# EAGLE schematic BCI_Module (EAGLE 6.4)
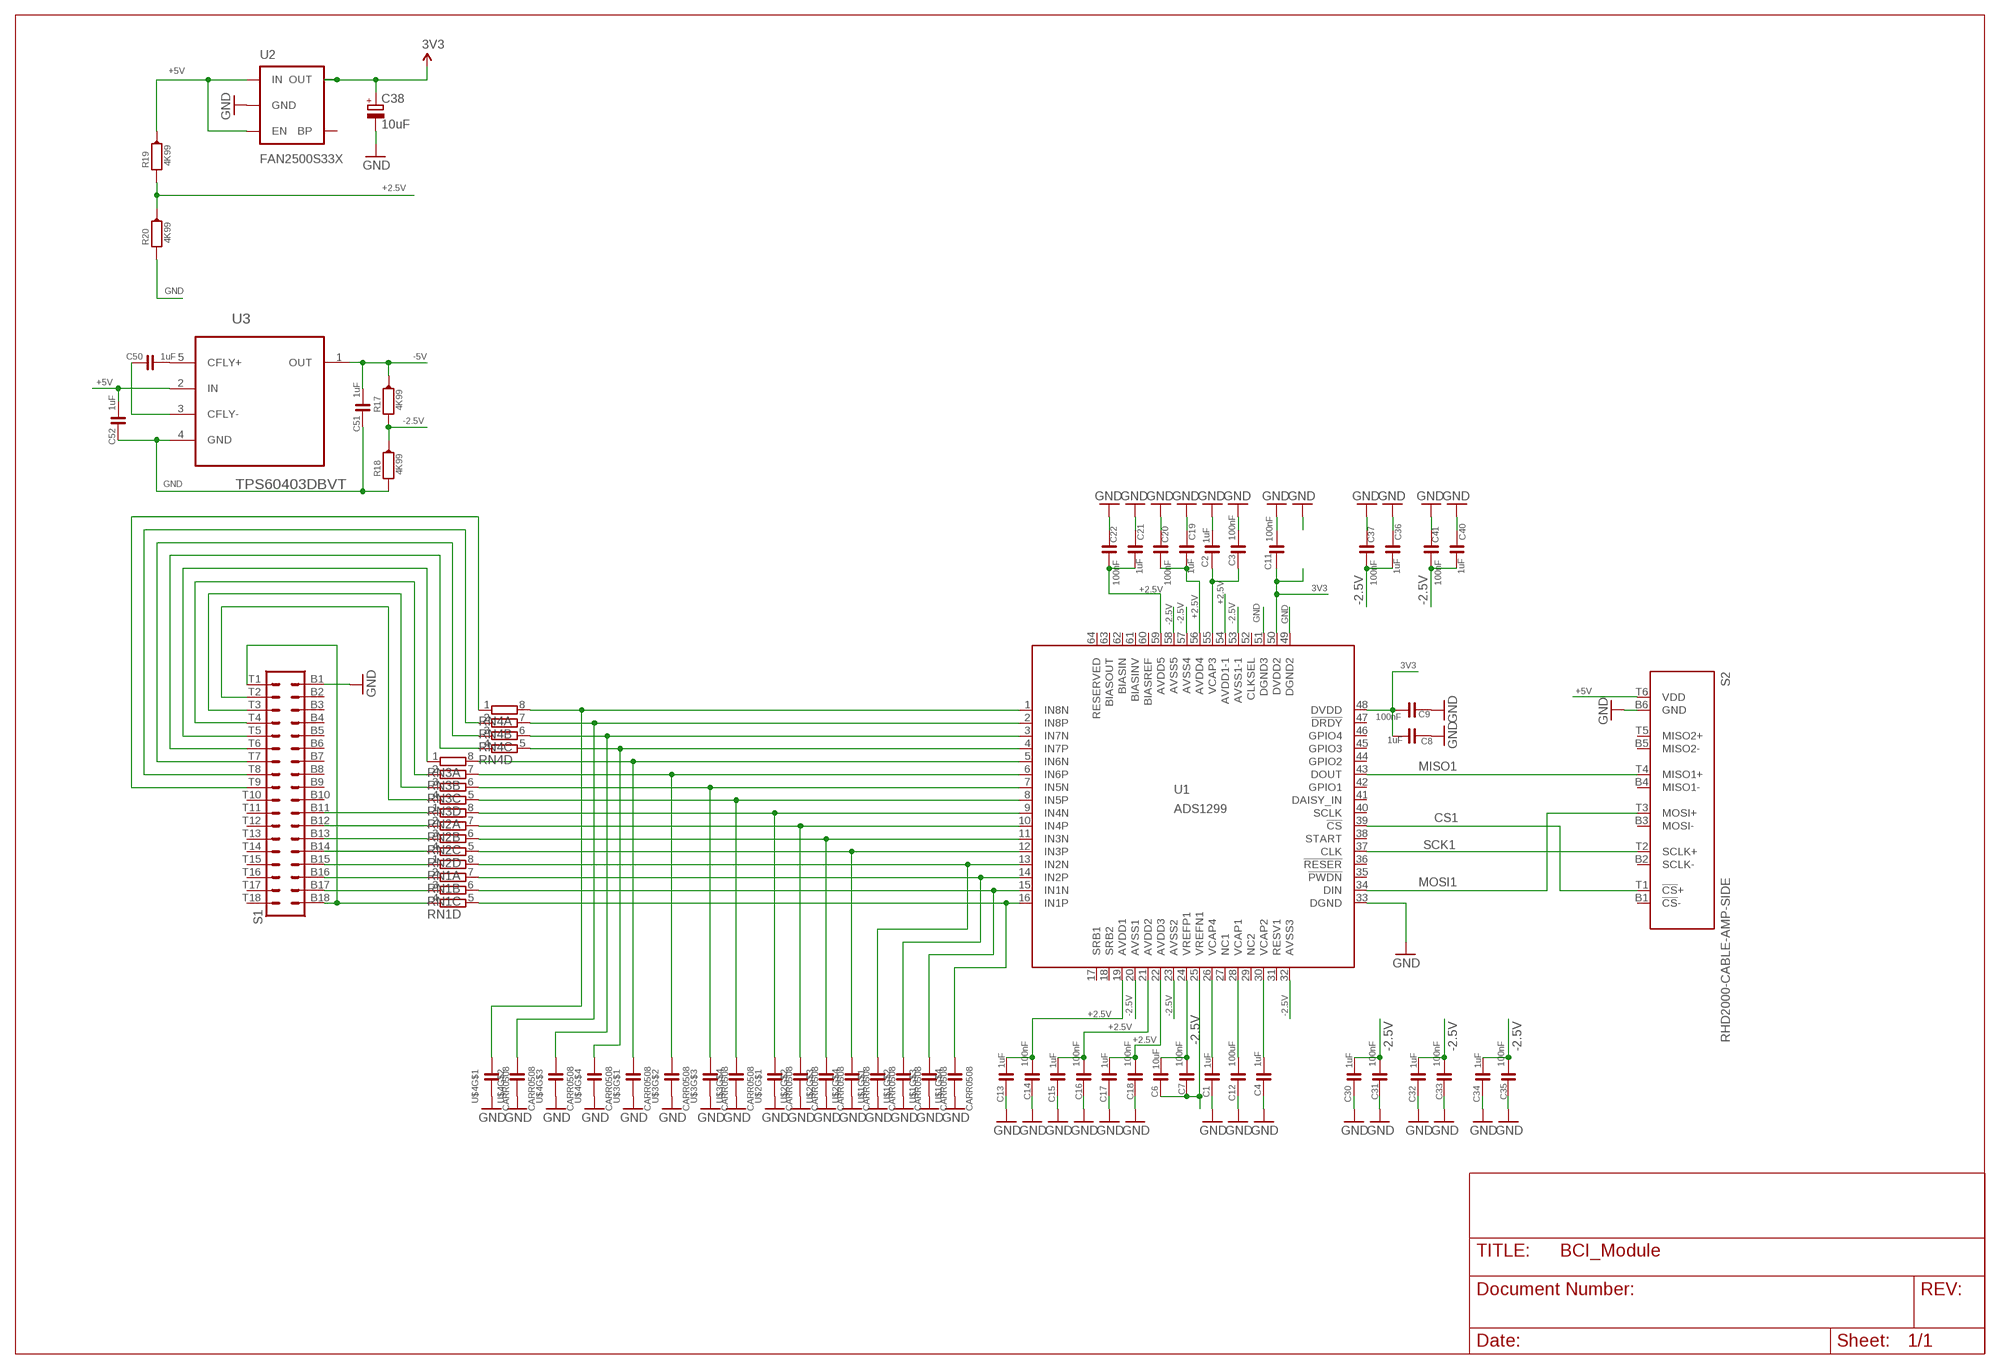
[diagram p0: schematic, sheet 1]

## Parts
C1  1uF  C0603_R  [0603_R]
C2  1uF  C0603_R  [0603_R]
C3  100nF  C0402_R  [0402_R]
C4  1uF  C0603_R  [0603_R]
C6  10uF  C0603_R  [0603_R]
C7  100nF  C0402_R  [0402_R]
C8  1uF  C0603_R  [0603_R]
C9  100nF  C0402_R  [0402_R]
C11  100nF  C0402_R  [0402_R]
C12  100uF  C1206_R  [1206_R]
C13  1uF  C0603_R  [0603_R]
C14  100nF  C0402_R  [0402_R]
C15  1uF  C0603_R  [0603_R]
C16  100nF  C0402_R  [0402_R]
C17  1uF  C0603_R  [0603_R]
C18  100nF  C0402_R  [0402_R]
C19  1uF  C0603_R  [0603_R]
C20  100nF  C0402_R  [0402_R]
C21  1uF  C0603_R  [0603_R]
C22  100nF  C0402_R  [0402_R]
C30  1uF  C0603_R  [0603_R]
C31  100nF  C0402_R  [0402_R]
C32  1uF  C0603_R  [0603_R]
C33  100nF  C0402_R  [0402_R]
C34  1uF  C0603_R  [0603_R]
C35  100nF  C0402_R  [0402_R]
C36  1uF  C0603_R  [0603_R]
C37  100nF  C0402_R  [0402_R]
C38  10uF  CPOL-EUR/2012-12R  [R/2012-12R]
C40  1uF  C0603_R  [0603_R]
C41  100nF  C0402_R  [0402_R]
C50  1uF  C0603_R  [0603_R]
C51  1uF  C0603_R  [0603_R]
C52  1uF  C0603_R  [0603_R]
R17  4K99  R0402_R  [0402_R@1]
R18  4K99  R0402_R  [0402_R@1]
R19  4K99  R0402_R  [0402_R@1]
R20  4K99  R0402_R  [0402_R@1]
RN1  4R-NYC124  [YC124]
RN2  4R-NYC124  [YC124]
RN3  4R-NYC124  [YC124]
RN4  4R-NYC124  [YC124]
S1  OMNETICS_A79025  [OMNETICS_A79025]
S2  RHD2000-CABLE-AMP-SIDE  [OMNETICS_PZN-12-AA]
U1  ADS1299  [SQFP-S-10X10-64]
U2  FAN2500S33X  V_REG_LDOSMD  [SOT23-5$2]
U3  TPS60403DBVT  [SOT95P280X145-5N]
U$1  CARR0508  [CARR0508]
U$2  CARR0508  [CARR0508]
U$3  CARR0508  [CARR0508]
U$4  CARR0508  [CARR0508]

## Nets
3V3: C8.1 C9.1 C11.1 C38.+ U1.48(DVDD) U1.50(DVDD2) U2.5(OUT)
+2.5V: C13.1 C14.1 C15.1 C16.1 C17.1 C18.1 C19.1 C20.1 C21.1 C22.1 R19.2 R20.1 U1.19(AVDD1) U1.21(AVDD2) U1.22(AVDD3) U1.54(AVDD1-1) U1.56(AVDD4) U1.59(AVDD5)
+5V: C52.1 R19.1 S2.T6(VDD) U2.1(IN) U2.3(EN) U3.2(IN)
-2.5V: C6.2 C7.2 C30.1 C31.1 C32.1 C33.1 C34.1 C35.1 C36.1 C37.1 C40.1 C41.1 R17.2 R18.1 U1.20(AVSS1) U1.23(AVSS2) U1.25(VREFN1) U1.32(AVSS3) U1.53(AVSS1-1) U1.57(AVSS4) U1.58(AVSS5)
-5V: C51.1 R17.1 U3.1(OUT)
CS1: S2.T1(!CS!+) U1.39(!CS)
GND: C1.2 C2.2 C3.2 C4.2 C8.2 C9.2 C11.2 C12.2 C13.2 C14.2 C15.2 C16.2 C17.2 C18.2 C19.2 C20.2 C21.2 C22.2 C30.2 C31.2 C32.2 C33.2 C34.2 C35.2 C36.2 C37.2 C38.- C40.2 C41.2 C51.2 C52.2 R18.2 R20.2 S1.B1 S2.B6(GND) U1.33(DGND) U1.49(DGND2) U1.51(DGND3) U2.2(GND) U3.4(GND) U$1.P$2 U$1.P$4 U$1.P$6 U$1.P$8 U$2.P$2 U$2.P$4 U$2.P$6 U$2.P$8 U$3.P$2 U$3.P$4 U$3.P$6 U$3.P$8 U$4.P$2 U$4.P$4 U$4.P$6 U$4.P$8
MISO1: S2.T4(MISO1+) U1.43(DOUT)
MOSI1: S2.T3(MOSI+) U1.34(DIN)
N$1: C1.1 U1.26(VCAP4)
N$2: C2.1 C3.1 U1.55(VCAP3)
N$4: C4.1 U1.30(VCAP2)
N$6: C6.1 C7.1 U1.24(VREFP1)
N$8: RN1.5 U1.16(IN1P) U$1.P$7
N$9: C12.1 U1.28(VCAP1)
N$10: RN1.1 S1.B15
N$11: RN1.2 S1.B16
N$12: RN1.3 S1.B17
N$13: RN1.4 S1.B18 S1.T1
N$14: RN2.8 U1.9(IN4N) U$2.P$1
N$15: RN2.7 U1.10(IN4P) U$2.P$3
N$16: RN2.6 U1.11(IN3N) U$2.P$5
N$17: RN2.5 U1.12(IN3P) U$2.P$7
N$18: RN2.1 S1.B11
N$19: RN2.2 S1.B12
N$20: RN2.3 S1.B13
N$21: RN2.4 S1.B14
N$22: RN3.8 U1.5(IN6N) U$3.P$1
N$23: RN3.7 U1.6(IN6P) U$3.P$3
N$24: RN3.6 U1.7(IN5N) U$3.P$5
N$25: RN3.5 U1.8(IN5P) U$3.P$7
N$26: C50.1 U3.5(CFLY+)
N$27: C50.2 U3.3(CFLY-)
N$28: RN3.4 S1.T2
N$29: RN3.3 S1.T3
N$30: RN3.2 S1.T4
N$31: RN3.1 S1.T5
N$32: RN4.8 U1.1(IN8N) U$4.P$1
N$33: RN4.7 U1.2(IN8P) U$4.P$3
N$34: RN4.6 U1.3(IN7N) U$4.P$5
N$35: RN4.5 U1.4(IN7P) U$4.P$7
N$36: RN4.4 S1.T6
N$37: RN4.3 S1.T7
N$38: RN4.2 S1.T8
N$39: RN4.1 S1.T9
N$44: RN1.7 U1.14(IN2P) U$1.P$3
N$45: RN1.8 U1.13(IN2N) U$1.P$1
N$48: RN1.6 U1.15(IN1N) U$1.P$5
SCK1: S2.T2(SCLK+) U1.37(CLK)
Unconnected: S1.B2 S1.B3 S1.B4 S1.B5 S1.B6 S1.B7 S1.B8 S1.B9 S1.B10 S1.T10 S1.T11 S1.T12 S1.T13 S1.T14 S1.T15 S1.T16 S1.T17 S1.T18 S2.B1(!CS!-) S2.B2(SCLK-) S2.B3(MOSI-) S2.B4(MISO1-) S2.B5(MISO2-) S2.T5(MISO2+) U1.17(SRB1) U1.18(SRB2) U1.27(NC1) U1.29(NC2) U1.31(RESV1) U1.35(!PWDN) U1.36(!RESER) U1.38(START) U1.40(SCLK) U1.41(DAISY_IN) U1.42(GPIO1) U1.45(GPIO3) U1.46(GPIO4) U1.47(!DRDY) U1.52(CLKSEL) U1.61(BIASINV) U1.62(BIASIN) U1.63(BIASOUT) U1.64(RESERVED) U2.4(BP)

## Power pins joined to a net without a drawn wire
BIASREF: U1.60(BIASREF)
GPIO2: U1.44(GPIO2)

## Library data of the parts
C1-C4 C6-C9 C11-C22 C30-C37 C40 C41 C50-C52 = PBF:C: Capacitors Coding: C_PITCH_LENGTH_WIDTH
C38 = resistor:CPOL-EU: POLARIZED CAPACITOR, European symbol
R17-R20 = PBF:R: Resistors
RN1-RN4 = resistor-dil:4R-N: Array Chip Resistor Source: RS Component / Phycomp; OC_FARNELL: unknown; OC_NEWARK: unknown
S1 = RHD2000:OMNETICS_A79025
S2 = RHD2000:RHD2000-CABLE-AMP-SIDE
U1 = yusuf:ADS1299
U2 = SparkFun:V_REG_LDO: Voltage Regulator LDO Standard 150mA LDO voltage regulator in SOT-23 layout. Micrel part MIC5205. BP (by-pass) pin is used to lower output noise with 470pF cap.
U3 = yusuf:TPS60403DBVT: Unregulated 60 mA Charge pump voltage Inverter; MPN: TPS60403DBVT; OC_FARNELL: 8457786; OC_NEWARK: 77C0632; PACKAGE: SOT-23-5; SUPPLIER: Texas Instruments
U$1-U$4 = PBF:CARR0508